# EAGLE design temperature (EAGLE 6.5.0)
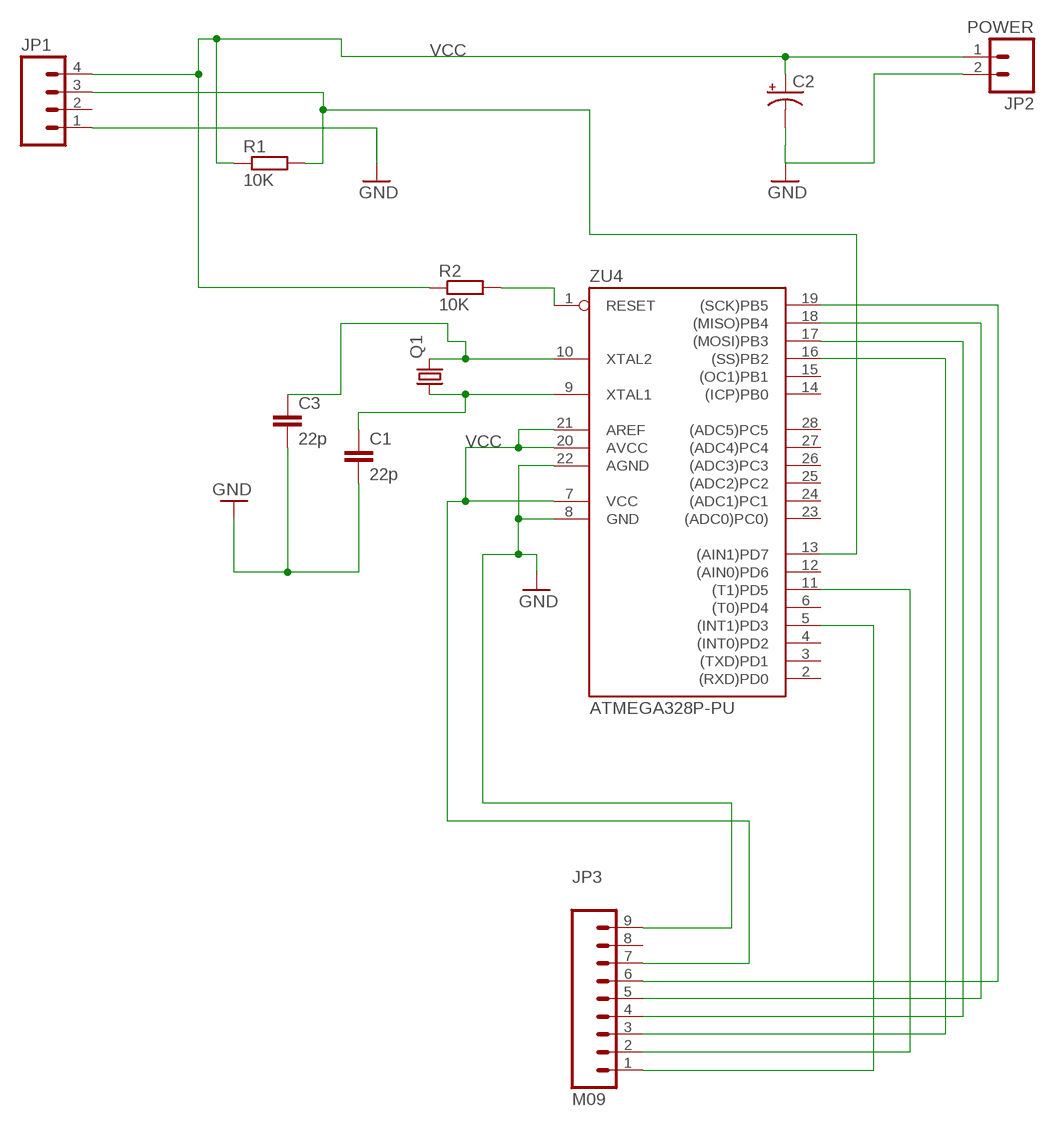
[diagram p0: schematic, sheet 1]

## Parts
C1  22p  C-EU050-025X075  [C050-025X075]
C2  CAP_POLPTH1  [CPOL-RADIAL-100UF-25V]
C3  22p  C-EU050-025X075  [C050-025X075]
JP1  M04PTH  [1X04]
JP2  POWER  M02PTH  [1X02]
JP3  M09  [1X09]
Q1  CRYSTALHC49S  [HC49/S]
R1  10K  R-EU_0207/7  [0207/7]
R2  10K  R-EU_0207/7  [0207/7]
ZU4  ATMEGA328P-PU  [DIL28-3]

## Nets
GND [gnd]: C1.2 C2.2(-) C3.2 JP1.1 JP2.2 JP3.9 ZU4.8(GND) ZU4.22(AGND)
N$1: JP3.2 ZU4.11((T1)PD5)
N$2: JP3.1 ZU4.5((INT1)PD3)
N$3: R2.2 ZU4.1(RESET)
N$4: C1.1 Q1.1 ZU4.9(XTAL1)
N$5: JP3.6 ZU4.19((SCK)PB5)
N$6: JP3.3 ZU4.16((SS)PB2)
N$19: JP3.5 ZU4.18((MISO)PB4)
N$20: JP3.4 ZU4.17((MOSI)PB3)
N$26: JP1.3 R1.2 ZU4.13((AIN1)PD7)
VCC [usbvcc]: C2.1(+) JP1.4 JP2.1 JP3.7 R1.1 R2.1 ZU4.7(VCC) ZU4.20(AVCC) ZU4.21(AREF)
XTAL2: C3.1 Q1.2 ZU4.10(XTAL2)
Unconnected: JP1.2 JP3.8 ZU4.2((RXD)PD0) ZU4.3((TXD)PD1) ZU4.4((INT0)PD2) ZU4.6((T0)PD4) ZU4.12((AIN0)PD6) ZU4.14((ICP)PB0) ZU4.15((OC1)PB1) ZU4.23((ADC0)PC0)) ZU4.24((ADC1)PC1) ZU4.25((ADC2)PC2) ZU4.26((ADC3)PC3) ZU4.27((ADC4)PC4) ZU4.28((ADC5)PC5)

## Library data of the parts
C1 C3 = resistor:C-EU: CAPACITOR, European symbol
C2 = SparkFun-Passives:CAP_POL: Capacitor Polarized These are standard SMD and PTH capacitors. Normally 10uF, 47uF, and 100uF in electrolytic and tantalum varieties. Always verify the external diameter of the through hole cap, it varies with capacity, voltage, and manufacturer. The EIA devices should be standard.
JP1 = SparkFun-Connectors:M04: Header 4 Standard 4-pin 0.1" header. Use with straight break away headers (SKU : PRT-00116), right angle break away headers (PRT-00553), swiss pins (PRT-00743), machine pins (PRT-00117), and female headers (PRT-00115). Molex polarized connector foot print use with SKU : PRT-08231 with associated crimp pins and housings. 1MM SMD Version SKU: PRT-10208
JP2 = SparkFun-Connectors:M02: Standard 2-pin 0.1" header. Use with - straight break away headers ( PRT-00116) - right angle break away headers (PRT-00553) - swiss pins (PRT-00743) - machine pins (PRT-00117) - female headers (PRT-00115) Molex polarized connector foot print use with: PRT-08233 with associated crimp pins and housings. 2.54_SCREWTERM for use with PRT-10571. 3.5mm Screw Terminal footprints for PRT-08084 5mm Screw Terminal footprints for use with PRT-08433
JP3 = SparkFun-Connectors:M09: Header 9 Standard 9-pin 0.1" header. Use with straight break away headers (SKU : PRT-00116), right angle break away headers (PRT-00553), swiss pins (PRT-00743), machine pins (PRT-00117), and female headers (PRT-00115).
Q1 = crystal:CRYSTAL: CRYSTAL; OC_FARNELL: 1667008; OC_NEWARK: unknown
R1 R2 = resistor:R-EU_: RESISTOR, European symbol
ZU4 = SmartPrj:ATMEGA328P-: MICROCONTROLLER 4 Kbytes FLASH 128 bytes SRAM 256 bytes EEPROM UART 6-channel 10 bit ADC

## Net classes
0 default: width 0.152 mm, clearance 0.152 mm
1 power: width 0.61 mm, drill 0.61 mm, clearance 0.254 mm
2 gnd: width 0.203 mm, drill 0.559 mm, clearance 0.152 mm
3 usbvcc: width 0.203 mm, drill 0.61 mm, clearance 0.152 mm
4 aref: width 0.406 mm, drill 0.61 mm, clearance 0.254 mm

## Board
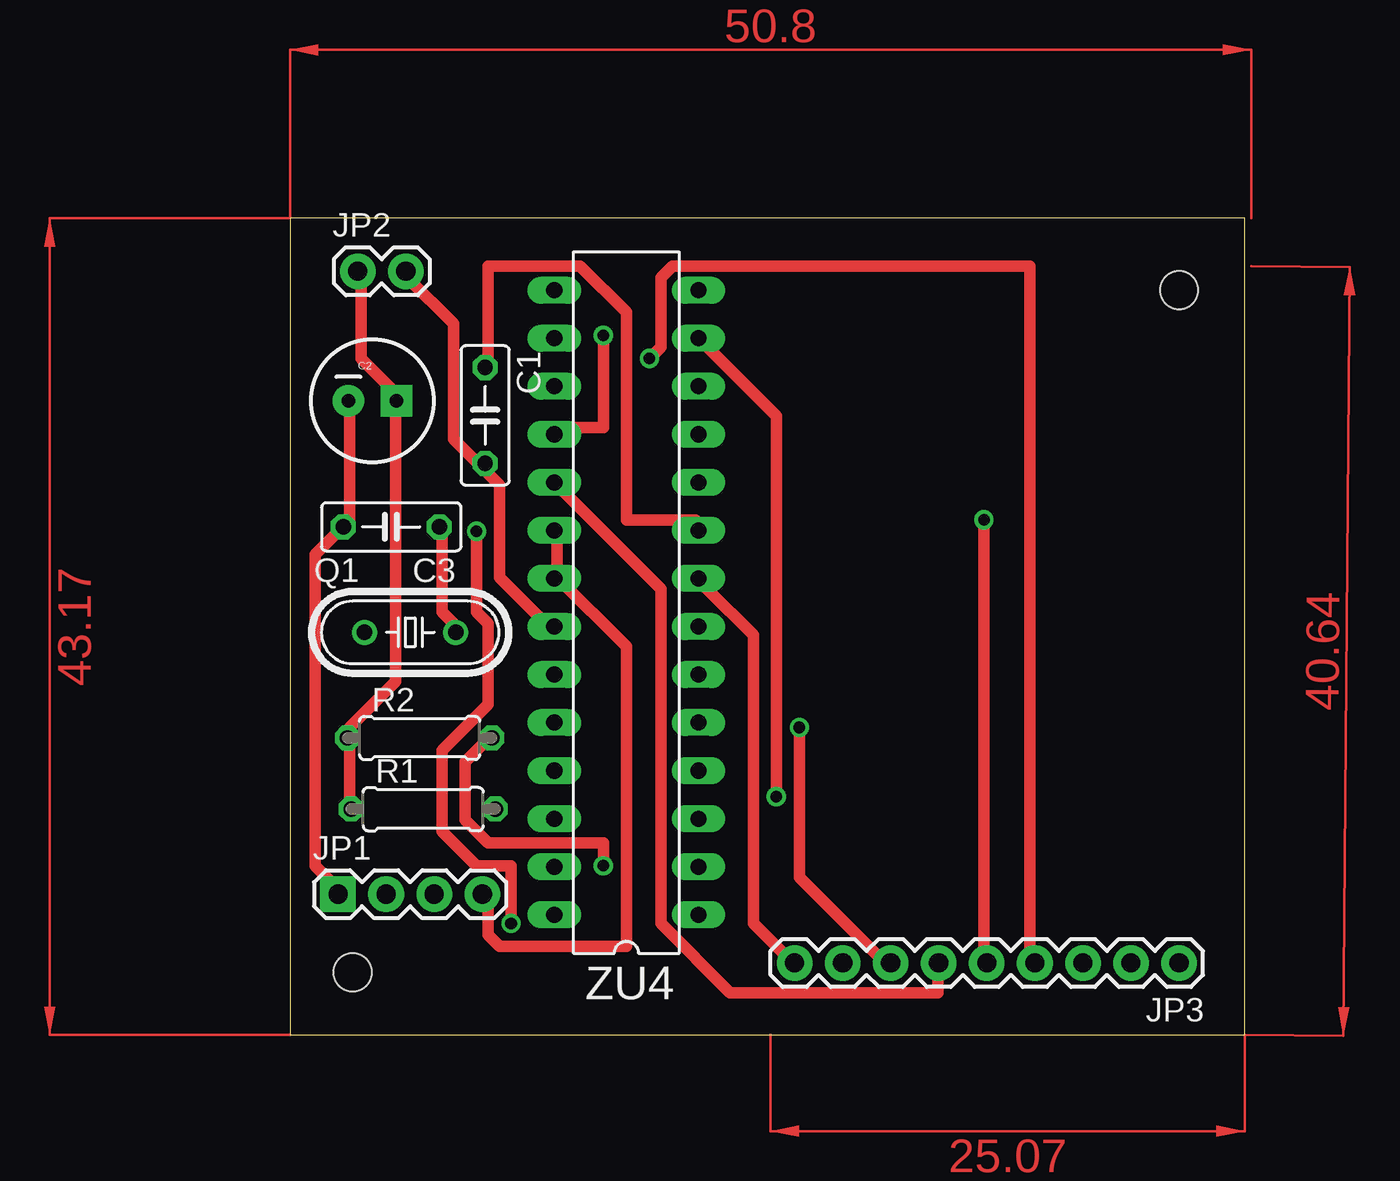
[diagram p1: board, top side]
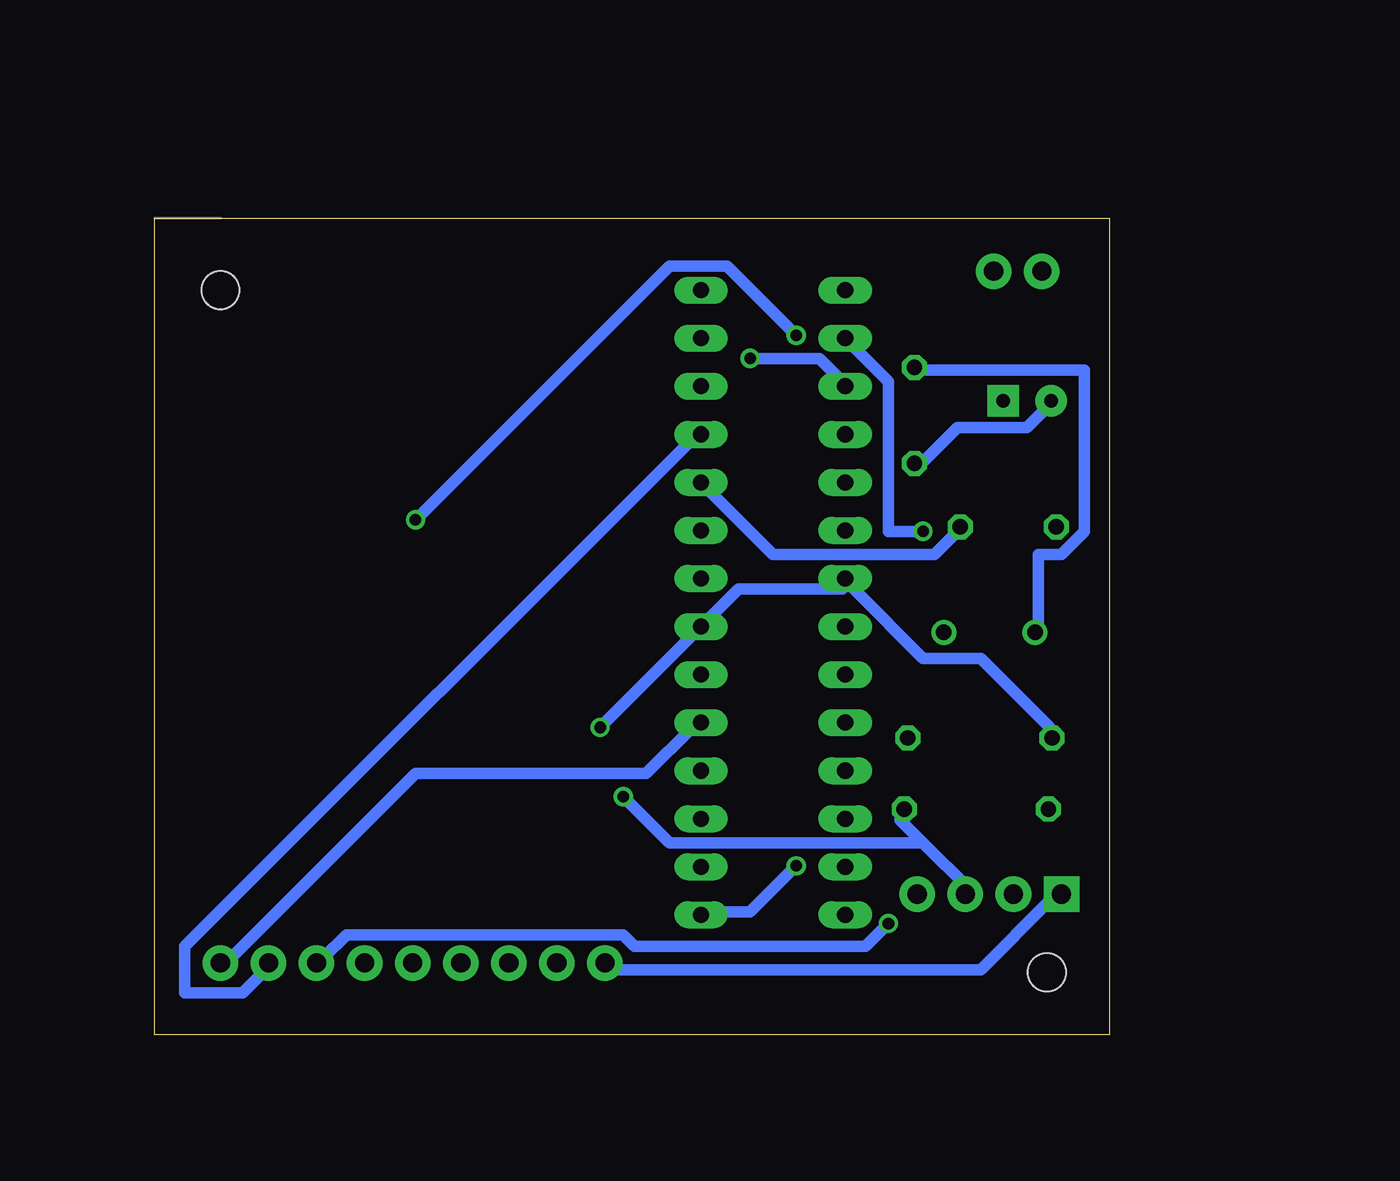
[diagram p2: board, bottom side, seen from below]

Size 50.47 x 43.17 mm. Coordinates in mm from the lower left corner, seen from the top.
Outline: 0,0 50.47,0 50.47,43.17 0,43.17 0,0
Copper layers (1*16): Top 0.035mm / dielectric 1.5mm / Bottom 0.035mm
Design rules "default *": minimum track width 24mil, minimum drill 24mil, track to track 10mil, track to pad 8mil, pad to pad 8mil, via to via 8mil, smd to smd 8mil, copper to edge 40mil, drill to drill 8mil, minimum pad ring 10mil, minimum via ring 8mil, stop-mask expansion 4mil, vias tented up to drill 0mil, thermal gap 10mil
Holes 2 mm at 46.99,39.37 3.31,3.31

### Footprints (pad centres in the part's own frame; a part is rotated, then mirrored left to right if it is on the bottom)
C050-025X075 = drill 0.813 octagon: 1 -2.54,0; 2 2.54,0
CPOL-RADIAL-100UF-25V = drill 0.7 pad 1.651 square: 1 1.27,0 | drill 0.7 pad 1.651: 2 -1.27,0
1X04 = drill 1.016 pad 1.88 square: 1 0,0 | drill 1.016 pad 1.88: 2 2.54,0; 3 5.08,0; 4 7.62,0
1X02 = drill 1.016 pad 1.88: 1 0,0; 2 2.54,0
1X09 = drill 1.016 pad 1.88: 1 0,0; 2 2.54,0; 3 5.08,0; 4 7.62,0; 5 10.16,0; 6 12.7,0; 7 15.24,0; 8 17.78,0; 9 20.32,0
HC49/S = drill 0.813: 1 -2.413,0; 2 2.413,0
0207/7 = drill 0.813 octagon: 1 -3.81,0; 2 3.81,0
DIL28-3 = drill 0.85 pad 1.422 long: 1 -16.51,-3.81; 2 -13.97,-3.81; 3 -11.43,-3.81; 4 -8.89,-3.81; 5 -6.35,-3.81; 6 -3.81,-3.81; 7 -1.27,-3.81; 8 1.27,-3.81; 9 3.81,-3.81; 10 6.35,-3.81; 11 8.89,-3.81; 12 11.43,-3.81; 13 13.97,-3.81; 14 16.51,-3.81; 15 16.51,3.81; 16 13.97,3.81; 17 11.43,3.81; 18 8.89,3.81; 19 6.35,3.81; 20 3.81,3.81; 21 1.27,3.81; 22 -1.27,3.81; 23 -3.81,3.81; 24 -6.35,3.81; 25 -8.89,3.81; 26 -11.43,3.81; 27 -13.97,3.81; 28 -16.51,3.81

### Placement (x,y rotation side)
C1  10.31,32.75 270 top
C2  4.35,33.52 0 top
C3  5.35,26.86 180 top
JP1  2.54,7.44 0 top
JP2  3.58,40.37 0 top
JP3  46.99,3.81 180 top
Q1  6.35,21.28 0 top
R1  7.04,11.94 0 top
R2  6.85,15.7 0 top
ZU4  17.78,22.86 90 top

### Tracks (layer width: path | path; a pad name or v marks a point on that pad's centre or on a via)
GND
  Top 0.61: ZU4.8 22.05,23.57 24.49,21.13 24.49,5.89 26.31,4.06 JP3.9 | C2.2 3.15,33.33 3.15,27.23 C3.2 2.54,26.62 1.32,25.4 1.32,8.94 2.54,7.72 JP1.1 | ZU4.22 13.51,21.74 11.07,24.18 11.07,29.06 10.46,29.67 C1.2 9.86,30.28 8.64,31.5 8.64,37.59 6.2,40.03 JP2.2
  Bottom 0.61: C1.2 9.86,30.28 8.03,32.11 4.37,32.11 3.15,33.33 C2.2 | JP3.9 26.31,3.45 6.81,3.45 3.15,7.11 2.54,7.11 JP1.1
N$1
  Bottom 0.61: ZU4.11 22.05,31.5 48.87,4.67 48.87,2.23 45.82,2.23 44.6,3.45 JP3.2
N$2
  Bottom 0.61: ZU4.5 22.05,16.26 24.49,13.82 36.68,13.82 46.43,4.06 JP3.1
N$3  (via drill 0.61)
  Top 0.61: v16.56,8.94 16.56,10.16 10.46,10.16 9.25,11.38 9.25,14.43 10.46,15.65 R2.2
  Bottom 0.61: v16.56,8.94 19,6.5 21.44,6.5 ZU4.1
N$4
  Top 0.61: ZU4.9 21.44,27.23 17.78,27.23 17.78,38.2 15.34,40.64 10.46,40.64 10.46,35.76 C1.1
  Bottom 0.61: Q1.1 3.76,21.74 3.76,25.4 2.54,25.4 1.32,26.62 1.32,35.15 9.86,35.15 C1.1
N$5
  Top 0.61: ZU4.19 19.61,23.57 19.61,5.89 23.27,2.23 34.24,2.23 34.24,3.45 JP3.6
N$6  (via drill 0.61)
  Top 0.61: v9.86,26.62 9.86,22.35 10.46,21.74 10.46,17.47 8.03,15.04 8.03,10.77 9.86,8.94 11.68,8.94 v11.68,5.89
  Bottom 0.61: ZU4.16 11.68,34.54 11.68,26.62 v9.86,26.62 | v11.68,5.89 12.9,4.67 25.09,4.67 25.7,5.28 40.34,5.28 41.55,4.06 JP3.3
N$19  (via drill 0.61)
  Top 0.61: v16.56,36.98 16.56,32.11 14.12,32.11 ZU4.18 | v36.68,27.23 36.68,4.06 JP3.5
  Bottom 0.61: v16.56,36.98 20.22,40.64 23.27,40.64 v36.68,27.23
N$20  (via drill 0.61)
  Top 0.61: v19,35.76 19.61,36.37 19.61,40.03 20.22,40.64 39.12,40.64 39.12,4.06 JP3.4
  Bottom 0.61: v19,35.76 15.34,35.76 14.12,34.54 ZU4.17
N$26  (via drill 0.61)
  Top 0.61: ZU4.13 25.7,32.72 v25.7,12.6
  Bottom 0.61: 9.86,10.16 7.42,7.72 JP1.3 | 9.86,10.16 11.07,11.38 R1.2 | v25.7,12.6 23.27,10.16 9.86,10.16
VCC  (via drill 0.61)
  Top 0.61: R1.1 3.15,11.99 3.15,15.65 R2.1 3.15,16.26 5.59,18.69 5.59,33.33 C2.1 5.59,33.93 3.76,35.76 3.76,40.03 JP2.1 | 14.12,24.18 14.12,26.62 ZU4.20 | v26.92,16.26 26.92,8.33 31.19,4.06 JP3.7 | 14.12,24.18 17.78,20.52 17.78,4.67 11.07,4.67 10.46,5.28 10.46,7.11 JP1.4 | 14.12,24.18 ZU4.21
  Bottom 0.61: v26.92,16.26 ZU4.7 19.61,23.57 14.12,23.57 ZU4.21 13.51,23.57 9.86,19.91 6.81,19.91 3.15,16.26 R2.1
XTAL2
  Top 0.61: Q1.2 8.64,21.74 8.03,22.35 8.03,26.62 C3.1
  Bottom 0.61: ZU4.10 17.78,25.4 9.25,25.4 8.03,26.62 C3.1
(copper drawn outside any net)
  shapes: Bottom area x1, Top area x4